# Altium project PS-010 Main.PrjPcb (part 2 of 2)

## Sheet Sheet4.SchDoc: Power Supply Board (Main)
size B; Organization: Let's Build Rockets Inc.; DocumentNumber: PS-010_Main; Revision: A.1; SheetNumber: 2
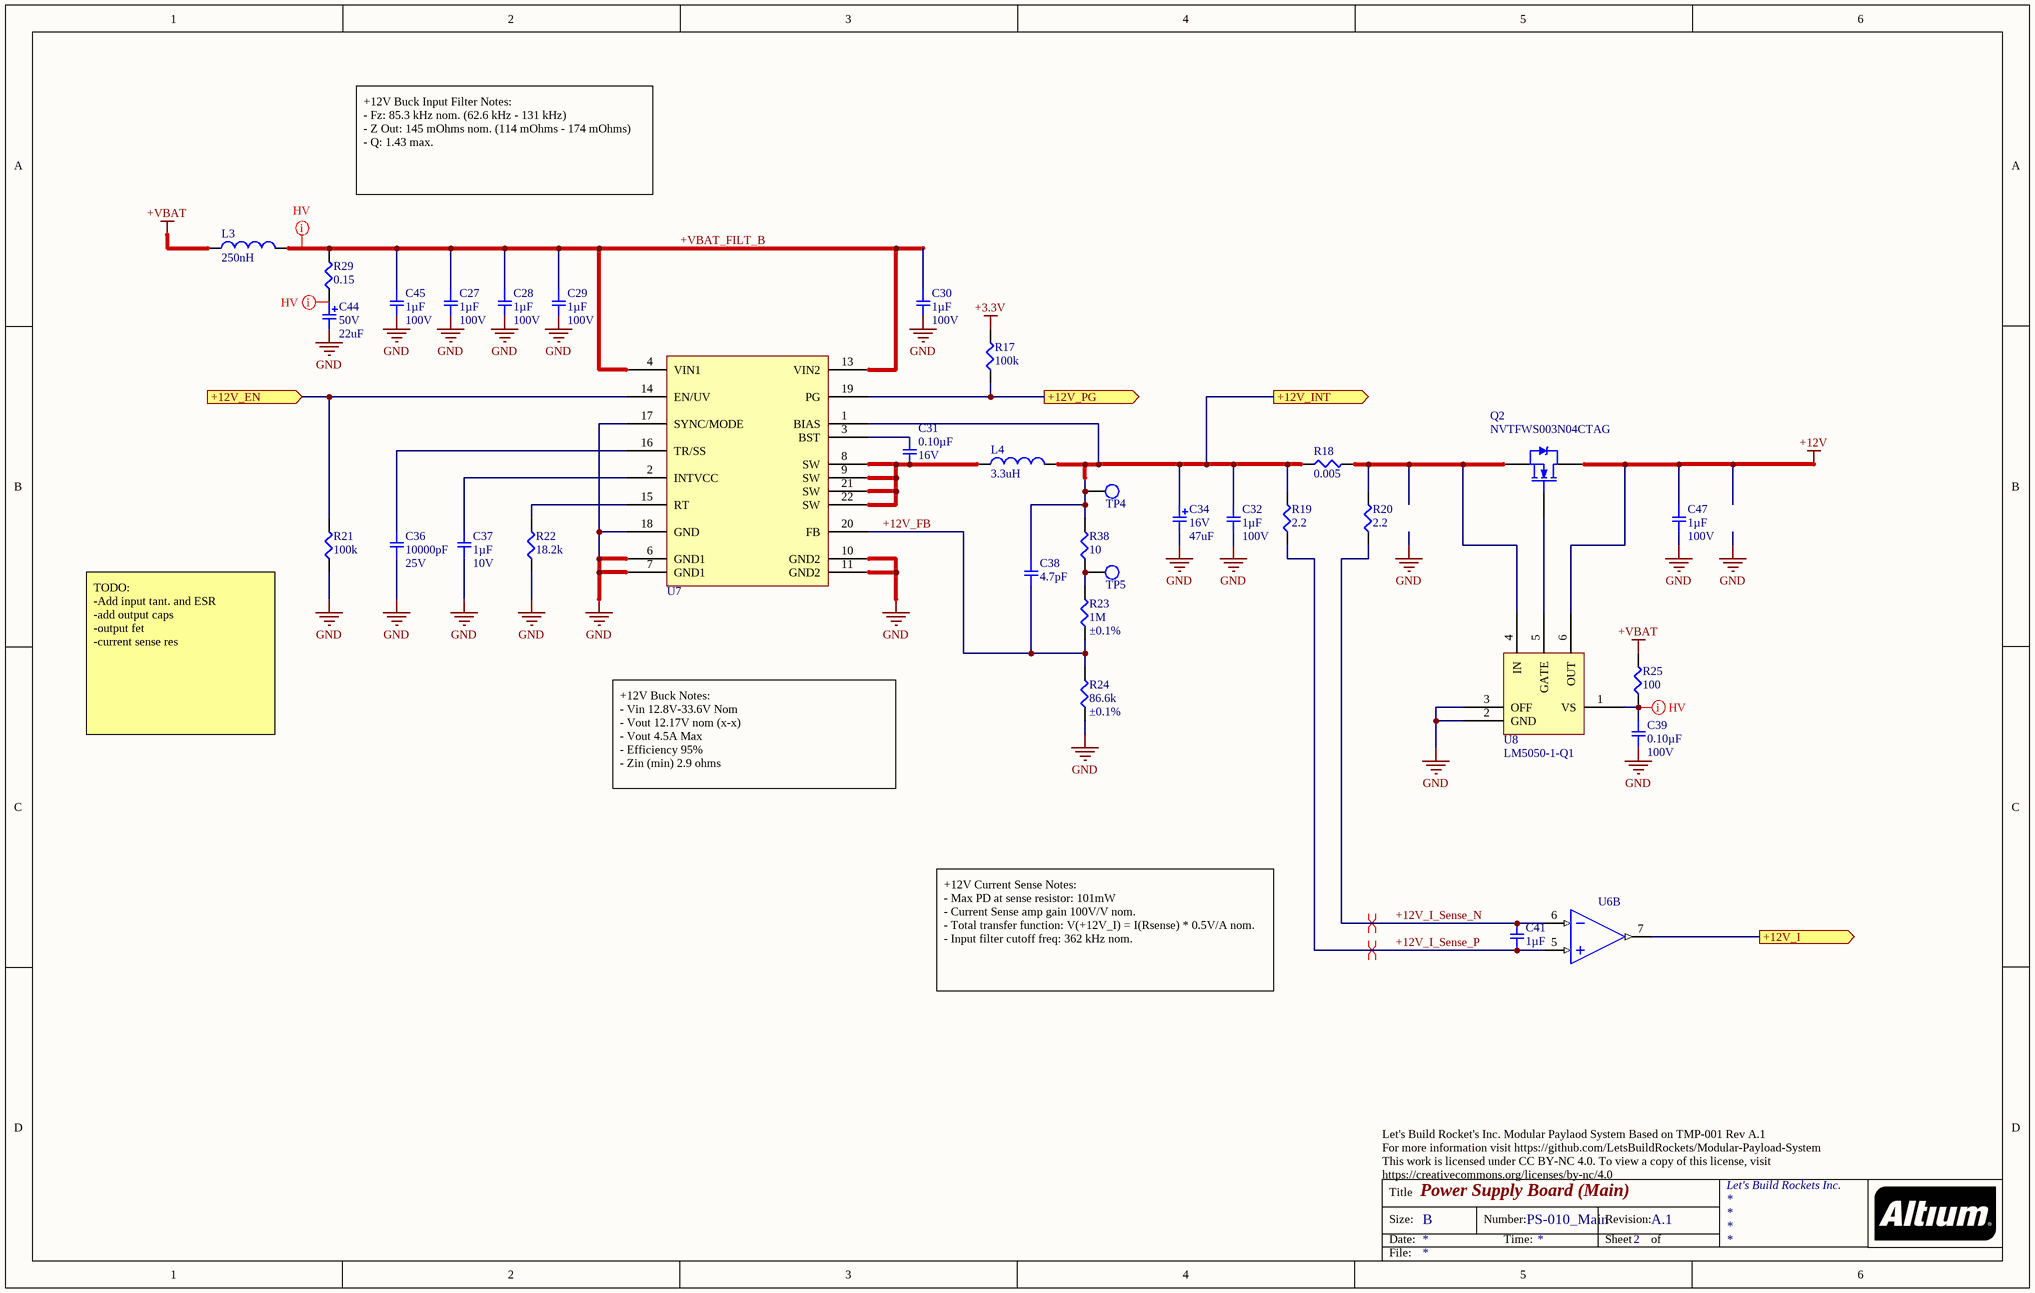
[diagram p3: Sheet4.SchDoc]

### Parts
C27  1µF  Voltage: 100V  [SMD-0805C]
C28  1µF  Voltage: 100V  [SMD-0805C]
C29  1µF  Voltage: 100V  [SMD-0805C]
C30  1µF  Voltage: 100V  [SMD-0805C]
C31  0.10µF  Voltage: 16V  [SMD-0402C]
C32  1µF  Voltage: 100V  [SMD-0805C]
C34  value 47uF  Voltage: 16V  [KEMET W - CAPMP7343X15N]  (hidden comment: T521W476M016ATE045)
C36  10000pF  Voltage: 25V  [SMD-0402C]
C37  1µF  Voltage: 10V  [SMD-0402C]
C38  4.7pF  [SMD-0402C]
C39  0.10µF  Voltage: 100V  [SMD-0603C]
C41  1µF  [SMD-0402C]
C44  value 22uF  Voltage: 50V  [KEMET D - CAPMP7343X31N]  (hidden comment: T521D226M050ATE090)
C45  1µF  Voltage: 100V  [SMD-0805C]
C47  1µF  Voltage: 100V  [SMD-0805C]
L3  value 250nH  [INDM4040X21N (XGL4020)]  (hidden comment: XGL4020-251ME)
L4  value 3.3uH  [INDM7050X50N (Wurth)]  (hidden comment: 744314330)
Q2  NVTFWS003N04CTAG  [DFN065P305X80-8N]
R17  100k  [SMD-0402-RES]
R18  0.005  [SMD-0603-RES]
R19  2.2  [SMD-0603-RES]
R20  2.2  [SMD-0603-RES]
R21  100k  [SMD-0402-RES]
R22  18.2k  [SMD-0402-RES]
R23  1M  Tolerance: ±0.1%  [SMD-0805-RES]
R24  86.6k  Tolerance: ±0.1%  [SMD-0805-RES]
R25  100  [SMD-0402-RES]
R29  0.15  [SMD-0603-RES]
R38  10  [SMD-0402-RES]
TP4  TP  [TP_SMD_40]  (value not drawn)  (no BOM)
TP5  TP  [TP_SMD_40]  (value not drawn)  (no BOM)
U6  INA2180A3IDGKT  [TSOP65P490X110-8N]  (value not drawn)  (part B of 2)
U7  LT8640  [QFN50P300X400X80_HS-21N (LT8640)]  (value not drawn)
U8  LM5050-1-Q1  [SOT95P280X110-6N]

### Ports
+12V_EN (in), +12V_I (out), +12V_INT (out), +12V_PG (out)

### Nets
+3.3V: R17.2
+12V: C47.1 Q2.D U8.6(OUT)
+VBAT: L3.1 R25.2
GND: C27.2 C28.2 C29.2 C30.2 C32.2 C34.2 C36.1 C37.1 C39.1 C44.2 C45.2 C47.2 R21.1 R22.1 R24.1 U7.6(GND1) U7.7(GND1) U7.10(GND2) U7.11(GND2) U7.17(SYNC/MODE) U7.18(GND) U8.2(GND) U8.3(OFF)
+12V_EN: R21.2 U7.14(EN/UV) ; port +12V_EN
+12V_FB: C38.2 R23.1 R24.2 U7.20(FB)
+12V_I: U6.7(OUT2) ; port +12V_I
+12V_I_Sense_N: C41.2 R20.1 U6.6(IN-2)
+12V_I_Sense_P: C41.1 R19.1 U6.5(IN+2)
+12V_INT: C32.1 C34.1 C38.1 L4.2 R18.1 R19.2 R38.2 TP4.1 U7.1(BIAS) ; port +12V_INT
+12V_PG: R17.1 U7.19(PG) ; port +12V_PG
+VBAT_FILT_B: C27.1 C28.1 C29.1 C30.1 C45.1 L3.2 R29.2 U7.4(VIN1) U7.13(VIN2)
NetC31_1: C31.1 U7.3(BST)
NetC31_2: C31.2 L4.1 U7.8(SW) U7.9(SW) U7.21(SW) U7.22(SW)
NetC36_2: C36.2 U7.16(TR/SS)
NetC37_2: C37.2 U7.2(INTVCC)
NetC39_2: C39.2 R25.1 U8.1(VS)
NetC44_1: C44.1 R29.1
NetQ2_G: Q2.G U8.5(GATE)
NetQ2_S: Q2.S R18.2 R20.2 U8.4(IN)
NetR22_2: R22.2 U7.15(RT)
NetR23_2: R23.2 R38.1 TP5.1

### Layout directives
differential pair: +12V_I_Sense_N, +12V_I_Sense_P
net class HIghVoltage: +VBAT_FILT_B, NetC39_2, NetC44_1

### Notes on the sheet
- +12V Buck Input Filter Notes:
  - Fz: 85.3 kHz nom. (62.6 kHz - 131 kHz)
  - Z Out: 145 mOhms nom. (114 mOhms - 174 mOhms)
  - Q: 1.43 max.
- TODO:
  -Add input tant. and ESR
  -add output caps
  -output fet
  -current sense res
- +12V Buck Notes:
  - Vin 12.8V-33.6V Nom
  - Vout 12.17V nom (x-x)
  - Vout 4.5A Max
  - Efficiency 95%
  - Zin (min) 2.9 ohms
- +12V Current Sense Notes:
  - Max PD at sense resistor: 101mW
  - Current Sense amp gain 100V/V nom.
  - Total transfer function: V(+12V_I) = I(Rsense) * 0.5V/A nom.
  - Input filter cutoff freq: 362 kHz nom.
- Let's Build Rocket's Inc. Modular Paylaod System Based on TMP-001 Rev A.1
  For more information visit https://github.com/LetsBuildRockets/Modular-Payload-System
  This work is licensed under CC BY-NC 4.0. To view a copy of this license, visit https://creativecommons.org/licenses/by-nc/4.0
- Title
- Size:
- Date:
- B
- Number:
- Time:
- Revision:
- Sheet
- of
- File:

### Library data of the parts
C27-C30 C32 C45 C47 = GRJ21BC72A105KE11L: CAP CER 1UF 100V X7S 0805; Manufacturer: Murata Electronics North America; Factory Stock: 0; Unit Price (USD): 0.47; Minimum Quantity: 1; Tolerance: ±10%; Datasheets: http://www.murata.com/~/media/webrenewal/support/library/catalog/products/capacitor/mlcc/c02e.pdf; Image: //media.digikey.com/Renders/Murata%20Renders/0805%20(2012%20Metric)%20.85mm.jpg; Digi-Key Part Number: 490-10918-1-ND; Part Number: GRJ21BC72A105KE11L; Quantity Available: 16015; @ qty: 0; Packaging: Cut Tape (CT); Series: GRJ; Part Status: Active; Value: 1µF; Temperature Coefficient: X7S; Operating Temperature: -55°C ~ 125°C; Features: Soft Termination; Ratings: -; Applications: Boardflex Sensitive; Mounting Type: Surface Mount, MLCC; Package / Case: 0805 (2012 Metric); Size / Dimension: 0.079" L x 0.049" W (2.00mm x 1.25mm); Height - Seated (Max): -; Thickness (Max): 0.057" (1.45mm); Lead Spacing: -; Lead Style: -
C31 = GCM155R71C104KA55D: CAP CER 0.1UF 16V X7R 0402; Manufacturer: Murata Electronics North America; Factory Stock: 0; Unit Price (USD): 0.1; Minimum Quantity: 1; Tolerance: ±10%; Datasheets: http://www.murata.com/~/media/webrenewal/support/library/catalog/products/capacitor/mlcc/c03e.ashx; Image: //media.digikey.com/Renders/Murata%20Renders/ZRB-SERIES-0402.jpg; Digi-Key Part Number: 490-4759-1-ND; Part Number: GCM155R71C104KA55D; Quantity Available: 734194; @ qty: 0; Packaging: Cut Tape (CT); Series: GCM; Part Status: Active; Value: 0.10µF; Temperature Coefficient: X7R; Operating Temperature: -55°C ~ 125°C; Features: -; Ratings: AEC-Q200; Applications: Automotive; Mounting Type: Surface Mount, MLCC; Package / Case: 0402 (1005 Metric); Size / Dimension: 0.039" L x 0.020" W (1.00mm x 0.50mm); Height - Seated (Max): -; Thickness (Max): 0.022" (0.55mm); Lead Spacing: -; Lead Style: -
C34 = T521W476M016ATE045: ESR: 45mohm
C36 = GCM155R71E103KA37D: CAP CER 10000PF 25V X7R 0402; Manufacturer: Murata Electronics North America; Factory Stock: 0; Unit Price (USD): 0.1; Minimum Quantity: 1; Tolerance: ±10%; Datasheets: http://www.murata.com/~/media/webrenewal/support/library/catalog/products/capacitor/mlcc/c03e.ashx; Image: //media.digikey.com/Renders/Murata%20Renders/ZRB-SERIES-0402.jpg; Digi-Key Part Number: 490-6043-1-ND; Part Number: GCM155R71E103KA37D; Quantity Available: 128782; @ qty: 0; Packaging: Cut Tape (CT); Series: GCM; Part Status: Active; Value: 10000pF; Temperature Coefficient: X7R; Operating Temperature: -55°C ~ 125°C; Features: -; Ratings: AEC-Q200; Applications: Automotive; Mounting Type: Surface Mount, MLCC; Package / Case: 0402 (1005 Metric); Size / Dimension: 0.039" L x 0.020" W (1.00mm x 0.50mm); Height - Seated (Max): -; Thickness (Max): 0.022" (0.55mm); Lead Spacing: -; Lead Style: -
C37 C41 = GCM155C71A105KE38D: CAP CER 1UF 10V X7S 0402; Manufacturer: Murata Electronics North America; Factory Stock: 0; Unit Price (USD): 0.12; Minimum Quantity: 1; Tolerance: ±10%; Datasheets: http://www.murata.com/~/media/webrenewal/support/library/catalog/products/capacitor/mlcc/c03e.ashx; Image: //media.digikey.com/Renders/Murata%20Renders/ZRB-SERIES-0402.jpg; Digi-Key Part Number: 490-13409-1-ND; Part Number: GCM155C71A105KE38D; Quantity Available: 7240; @ qty: 0; Packaging: Cut Tape (CT); Series: GCM; Part Status: Active; Value: 1µF; Temperature Coefficient: X7S; Operating Temperature: -55°C ~ 125°C; Features: -; Ratings: AEC-Q200; Applications: Automotive; Mounting Type: Surface Mount, MLCC; Package / Case: 0402 (1005 Metric); Size / Dimension: 0.039" L x 0.020" W (1.00mm x 0.50mm); Height - Seated (Max): -; Thickness (Max): 0.022" (0.55mm); Lead Spacing: -; Lead Style: -
  C41: Voltage: 10V
C38 = GCM1555C1H4R7CA16D: CAP CER 4.7PF 50V NP0 0402; Manufacturer: Murata Electronics North America; Factory Stock: 0; Unit Price (USD): 0.1; Minimum Quantity: 1; Tolerance: ±0.25pF; Temperature Coefficient: C0G, NP0; Datasheets: http://www.murata.com/~/media/webrenewal/support/library/catalog/products/capacitor/mlcc/c03e.ashx; Image: //media.digikey.com/Renders/Murata%20Renders/ZRB-SERIES-0402.jpg; Digi-Key Part Number: 490-12652-1-ND; Part Number: GCM1555C1H4R7CA16D; Quantity Available: 7400; @ qty: 0; Packaging: Cut Tape (CT); Series: GCM; Part Status: Active; Value: 4.7pF; Voltage: 50V; Operating Temperature: -55°C ~ 125°C; Features: -; Ratings: AEC-Q200; Applications: Automotive; Mounting Type: Surface Mount, MLCC; Package / Case: 0402 (1005 Metric); Size / Dimension: 0.039" L x 0.020" W (1.00mm x 0.50mm); Height - Seated (Max): -; Thickness (Max): 0.022" (0.55mm); Lead Spacing: -; Lead Style: -
C39 = GRM188R72A104KA35D: CAP CER 0.1UF 100V X7R 0603; Manufacturer: Murata Electronics North America; Factory Stock: 0; Unit Price (USD): 0.2; Minimum Quantity: 1; Tolerance: ±10%; Datasheets: http://www.murata.com/~/media/webrenewal/support/library/catalog/products/capacitor/mlcc/c02e.pdf; Image: //media.digikey.com/Renders/Murata%20Renders/ZRB-SERIES-0402.jpg; Digi-Key Part Number: 490-3285-1-ND; Part Number: GRM188R72A104KA35D; Quantity Available: 924944; @ qty: 0; Packaging: Cut Tape (CT); Series: GRM; Part Status: Active; Value: 0.10µF; Temperature Coefficient: X7R; Operating Temperature: -55°C ~ 125°C; Features: -; Ratings: -; Applications: General Purpose; Mounting Type: Surface Mount, MLCC; Package / Case: 0603 (1608 Metric); Size / Dimension: 0.063" L x 0.031" W (1.60mm x 0.80mm); Height - Seated (Max): -; Thickness (Max): 0.035" (0.90mm); Lead Spacing: -; Lead Style: -
C44 = T521D226M050ATE090: ESR: 90mohm
L3 = XGL4020-251ME: DCR: 3.0mohm; Isat: 16.5A; Imax: 24A; SFR: 130MHz
L4 = 744314330: DCR: 9mohm; Isat: 8A; Imax: 9A; SFR: 65MHz; Tolerance: 20%
Q2 = NVTFWS003N04CTAG: Rds: 3.5mohm; Vgs: 20V; Power Dissipation: 3.2W; Id: 22A; VDS: 40V; Qg: 23nC; Ciss: 1600pF; Operating Temperature: -55°C ~ 175°C
R17 R21 = ERJ-2GEJ104X: RES SMD 100K OHM 5% 1/10W 0402; Manufacturer: Panasonic Electronic Components; Factory Stock: 0; Unit Price (USD): 0.00350; @ qty: 1500; Minimum Quantity: 1; Power (Watts): 0.1W, 1/10W; Temperature Coefficient: ±200ppm/°C; Part Number: ERJ-2GEJ104X; Datasheets: http://industrial.panasonic.com/www-cgi/jvcr13pz.cgi?E+PZ+3+AOA0001+ERJ2GEJ104X+7+WW; Image: //media.digikey.com/Photos/Panasonic%20Photos/ERJ-PA2-Series.jpg; Digi-Key Part Number: P100KJCT-ND; Quantity Available: 2387986; Packaging: Cut Tape (CT); Series: ERJ; Part Status: Active; Value: 100k; Tolerance: ±5%; Composition: Thick Film; Features: Automotive AEC-Q200; Operating Temperature: -55°C ~ 155°C; Package / Case: 0402 (1005 Metric); Supplier Device Package: 0402; Size / Dimension: 0.039" L x 0.020" W (1.00mm x 0.50mm); Height - Seated (Max): 0.016" (0.40mm); Number of Terminations: 2; Failure Rate: -
R18 = ERJ-3LWFR005V: RES SMD 0.005 OHM 1% 1/4W 0603; Manufacturer: Panasonic Electronic Components; Factory Stock: 0; Unit Price (USD): 0.12384; @ qty: 1500; Minimum Quantity: 1; Power (Watts): 0.25W, 1/4W; Temperature Coefficient: 0/ +700ppm/°C; Part Number: ERJ-3LWFR005V; Datasheets: https://industrial.panasonic.com/cdbs/www-data/pdf/RDA0000/AOA0000C239.pdf; Image: //media.digikey.com/Photos/Panasonic%20Photos/MFG_ERJ-P6W%20Series.jpg; Digi-Key Part Number: P19182CT-ND; Quantity Available: 2588; Packaging: Cut Tape (CT); Series: ERJ; Part Status: Active; Value: 0.005; Tolerance: ±1%; Composition: Thick Film; Features: Automotive AEC-Q200, Current Sense; Operating Temperature: -55°C ~ 125°C; Package / Case: 0603 (1608 Metric); Supplier Device Package: 0603; Size / Dimension: 0.063" L x 0.031" W (1.60mm x 0.80mm); Height - Seated (Max): 0.026" (0.65mm); Number of Terminations: 2; Failure Rate: -
R19 R20 = ERJ-3RQF2R2V: RES SMD 2.2 OHM 1% 1/10W 0603; Manufacturer: Panasonic Electronic Components; Factory Stock: 0; Unit Price (USD): 0.03510; @ qty: 1500; Minimum Quantity: 1; Power (Watts): 0.1W, 1/10W; Temperature Coefficient: ±200ppm/°C; Part Number: ERJ-3RQF2R2V; Datasheets: https://industrial.panasonic.com/cdbs/www-data/pdf/RDA0000/AOA0000C239.pdf; Image: //media.digikey.com/Photos/Panasonic%20Photos/MFG_ERJ-P6W%20Series.jpg; Digi-Key Part Number: P2.2AJCT-ND; Quantity Available: 43930; Packaging: Cut Tape (CT); Series: ERJ; Part Status: Active; Value: 2.2; Tolerance: ±1%; Composition: Thick Film; Features: Automotive AEC-Q200, Current Sense; Operating Temperature: -55°C ~ 125°C; Package / Case: 0603 (1608 Metric); Supplier Device Package: 0603; Size / Dimension: 0.063" L x 0.031" W (1.60mm x 0.80mm); Height - Seated (Max): 0.022" (0.55mm); Number of Terminations: 2; Failure Rate: -
R22 = ERJ-2RKF1822X: RES SMD 18.2K OHM 1% 1/10W 0402; Manufacturer: Panasonic Electronic Components; Factory Stock: 0; Unit Price (USD): 0.00496; @ qty: 1500; Minimum Quantity: 1; Power (Watts): 0.1W, 1/10W; Temperature Coefficient: ±100ppm/°C; Part Number: ERJ-2RKF1822X; Datasheets: http://industrial.panasonic.com/www-cgi/jvcr13pz.cgi?E+PZ+3+AOA0002+ERJ2RKF1822X+7+WW; Image: //media.digikey.com/Photos/Panasonic%20Photos/ERJ-PA2-Series.jpg; Digi-Key Part Number: P18.2KLCT-ND; Quantity Available: 142975; Packaging: Cut Tape (CT); Series: ERJ; Part Status: Active; Value: 18.2k; Tolerance: ±1%; Composition: Thick Film; Features: Automotive AEC-Q200; Operating Temperature: -55°C ~ 155°C; Package / Case: 0402 (1005 Metric); Supplier Device Package: 0402; Size / Dimension: 0.039" L x 0.020" W (1.00mm x 0.50mm); Height - Seated (Max): 0.016" (0.40mm); Number of Terminations: 2; Failure Rate: -
R23 = ERJ-PB6B1004V: RES SMD 1M OHM 0.1% 1/4W 0805; Manufacturer: Panasonic Electronic Components; Factory Stock: 0; Unit Price (USD): 0.04554; @ qty: 1000; Minimum Quantity: 1; Power (Watts): 0.25W, 1/4W; Temperature Coefficient: ±50ppm/°C; Part Number: ERJ-PB6B1004V; Datasheets: https://industrial.panasonic.com/cdbs/www-data/pdf/RDA0000/AOA0000C100.pdf; Image: //media.digikey.com/Renders/Panasonic%20Renders/ERJ-0805%20Pkg.jpg; Digi-Key Part Number: P20936CT-ND; Quantity Available: 10000; Packaging: Cut Tape (CT); Series: ERJ; Part Status: Active; Value: 1M; Composition: Thick Film; Features: Automotive AEC-Q200, Pulse Withstanding; Operating Temperature: -55°C ~ 155°C; Package / Case: 0805 (2012 Metric); Supplier Device Package: 0805; Size / Dimension: 0.079" L x 0.049" W (2.00mm x 1.25mm); Height - Seated (Max): 0.028" (0.70mm); Number of Terminations: 2; Failure Rate: -
R24 = ERJ-PB6B8662V: RES SMD 86.6k OHM 0.1% 1/4W 0805; Manufacturer: Panasonic Electronic Components; Factory Stock: 0; Unit Price (USD): 0.04554; @ qty: 1000; Minimum Quantity: 1; Power (Watts): 0.25W, 1/4W; Temperature Coefficient: ±50ppm/°C; Part Number: ERJ-PB6B8662V; Datasheets: https://industrial.panasonic.com/cdbs/www-data/pdf/RDA0000/AOA0000C100.pdf; Image: //media.digikey.com/Renders/Panasonic%20Renders/ERJ-0805%20Pkg.jpg; Digi-Key Part Number: P20815CT-ND; Quantity Available: 10000; Packaging: Cut Tape (CT); Series: ERJ; Part Status: Active; Value: 86.6k; Composition: Thick Film; Features: Automotive AEC-Q200, Pulse Withstanding; Operating Temperature: -55°C ~ 155°C; Package / Case: 0805 (2012 Metric); Supplier Device Package: 0805; Size / Dimension: 0.079" L x 0.049" W (2.00mm x 1.25mm); Height - Seated (Max): 0.028" (0.70mm); Number of Terminations: 2; Failure Rate: -
R25 = ERJ-2GEJ101X: RES SMD 100 OHM 5% 1/10W 0402; Manufacturer: Panasonic Electronic Components; Factory Stock: 0; Unit Price (USD): 0.00350; @ qty: 1500; Minimum Quantity: 1; Power (Watts): 0.1W, 1/10W; Temperature Coefficient: ±200ppm/°C; Part Number: ERJ-2GEJ101X; Datasheets: http://industrial.panasonic.com/www-cgi/jvcr13pz.cgi?E+PZ+3+AOA0001+ERJ2GEJ101X+7+WW; Image: //media.digikey.com/Photos/Panasonic%20Photos/ERJ-PA2-Series.jpg; Digi-Key Part Number: P100JCT-ND; Quantity Available: 3114113; Packaging: Cut Tape (CT); Series: ERJ; Part Status: Active; Value: 100; Tolerance: ±5%; Composition: Thick Film; Features: Automotive AEC-Q200; Operating Temperature: -55°C ~ 155°C; Package / Case: 0402 (1005 Metric); Supplier Device Package: 0402; Size / Dimension: 0.039" L x 0.020" W (1.00mm x 0.50mm); Height - Seated (Max): 0.016" (0.40mm); Number of Terminations: 2; Failure Rate: -
R29 = ERJ-3BSJR15V: RES SMD 0.15 OHM 5% 1/4W 0603; Manufacturer: Panasonic Electronic Components; Factory Stock: 0; Unit Price (USD): 0.05207; @ qty: 1500; Minimum Quantity: 1; Power (Watts): 0.25W, 1/4W; Temperature Coefficient: ±300ppm/°C; Part Number: ERJ-3BSJR15V; Datasheets: https://industrial.panasonic.com/cdbs/www-data/pdf/RDA0000/AOA0000C239.pdf; Image: //media.digikey.com/Photos/Panasonic%20Photos/MFG_ERJ-P6W%20Series.jpg; Digi-Key Part Number: P17248CT-ND; Quantity Available: 4990; Packaging: Cut Tape (CT); Series: ERJ; Part Status: Active; Value: 0.15; Tolerance: ±5%; Composition: Thick Film; Features: Automotive AEC-Q200, Current Sense; Operating Temperature: -55°C ~ 125°C; Package / Case: 0603 (1608 Metric); Supplier Device Package: 0603; Size / Dimension: 0.063" L x 0.031" W (1.60mm x 0.80mm); Height - Seated (Max): 0.022" (0.55mm); Number of Terminations: 2; Failure Rate: -
R38 = ERJ-2GEJ100X: RES SMD 10 OHM 5% 1/10W 0402; Manufacturer: Panasonic Electronic Components; Factory Stock: 0; Unit Price (USD): 0.00350; @ qty: 1500; Minimum Quantity: 1; Power (Watts): 0.1W, 1/10W; Temperature Coefficient: ±200ppm/°C; Part Number: ERJ-2GEJ100X; Datasheets: http://industrial.panasonic.com/www-cgi/jvcr13pz.cgi?E+PZ+3+AOA0001+ERJ2GEJ100X+7+WW; Image: //media.digikey.com/Photos/Panasonic%20Photos/ERJ-PA2-Series.jpg; Digi-Key Part Number: P10JCT-ND; Quantity Available: 1054751; Packaging: Cut Tape (CT); Series: ERJ; Part Status: Active; Value: 10; Tolerance: ±5%; Composition: Thick Film; Features: Automotive AEC-Q200; Operating Temperature: -55°C ~ 155°C; Package / Case: 0402 (1005 Metric); Supplier Device Package: 0402; Size / Dimension: 0.039" L x 0.020" W (1.00mm x 0.50mm); Height - Seated (Max): 0.016" (0.40mm); Number of Terminations: 2; Failure Rate: -

## Sheet Sheet5.SchDoc: Power Supply Board (Main)
size B; Organization: Let's Build Rockets Inc.; DocumentNumber: PS-010_Main; Revision: A.1; SheetNumber: 2
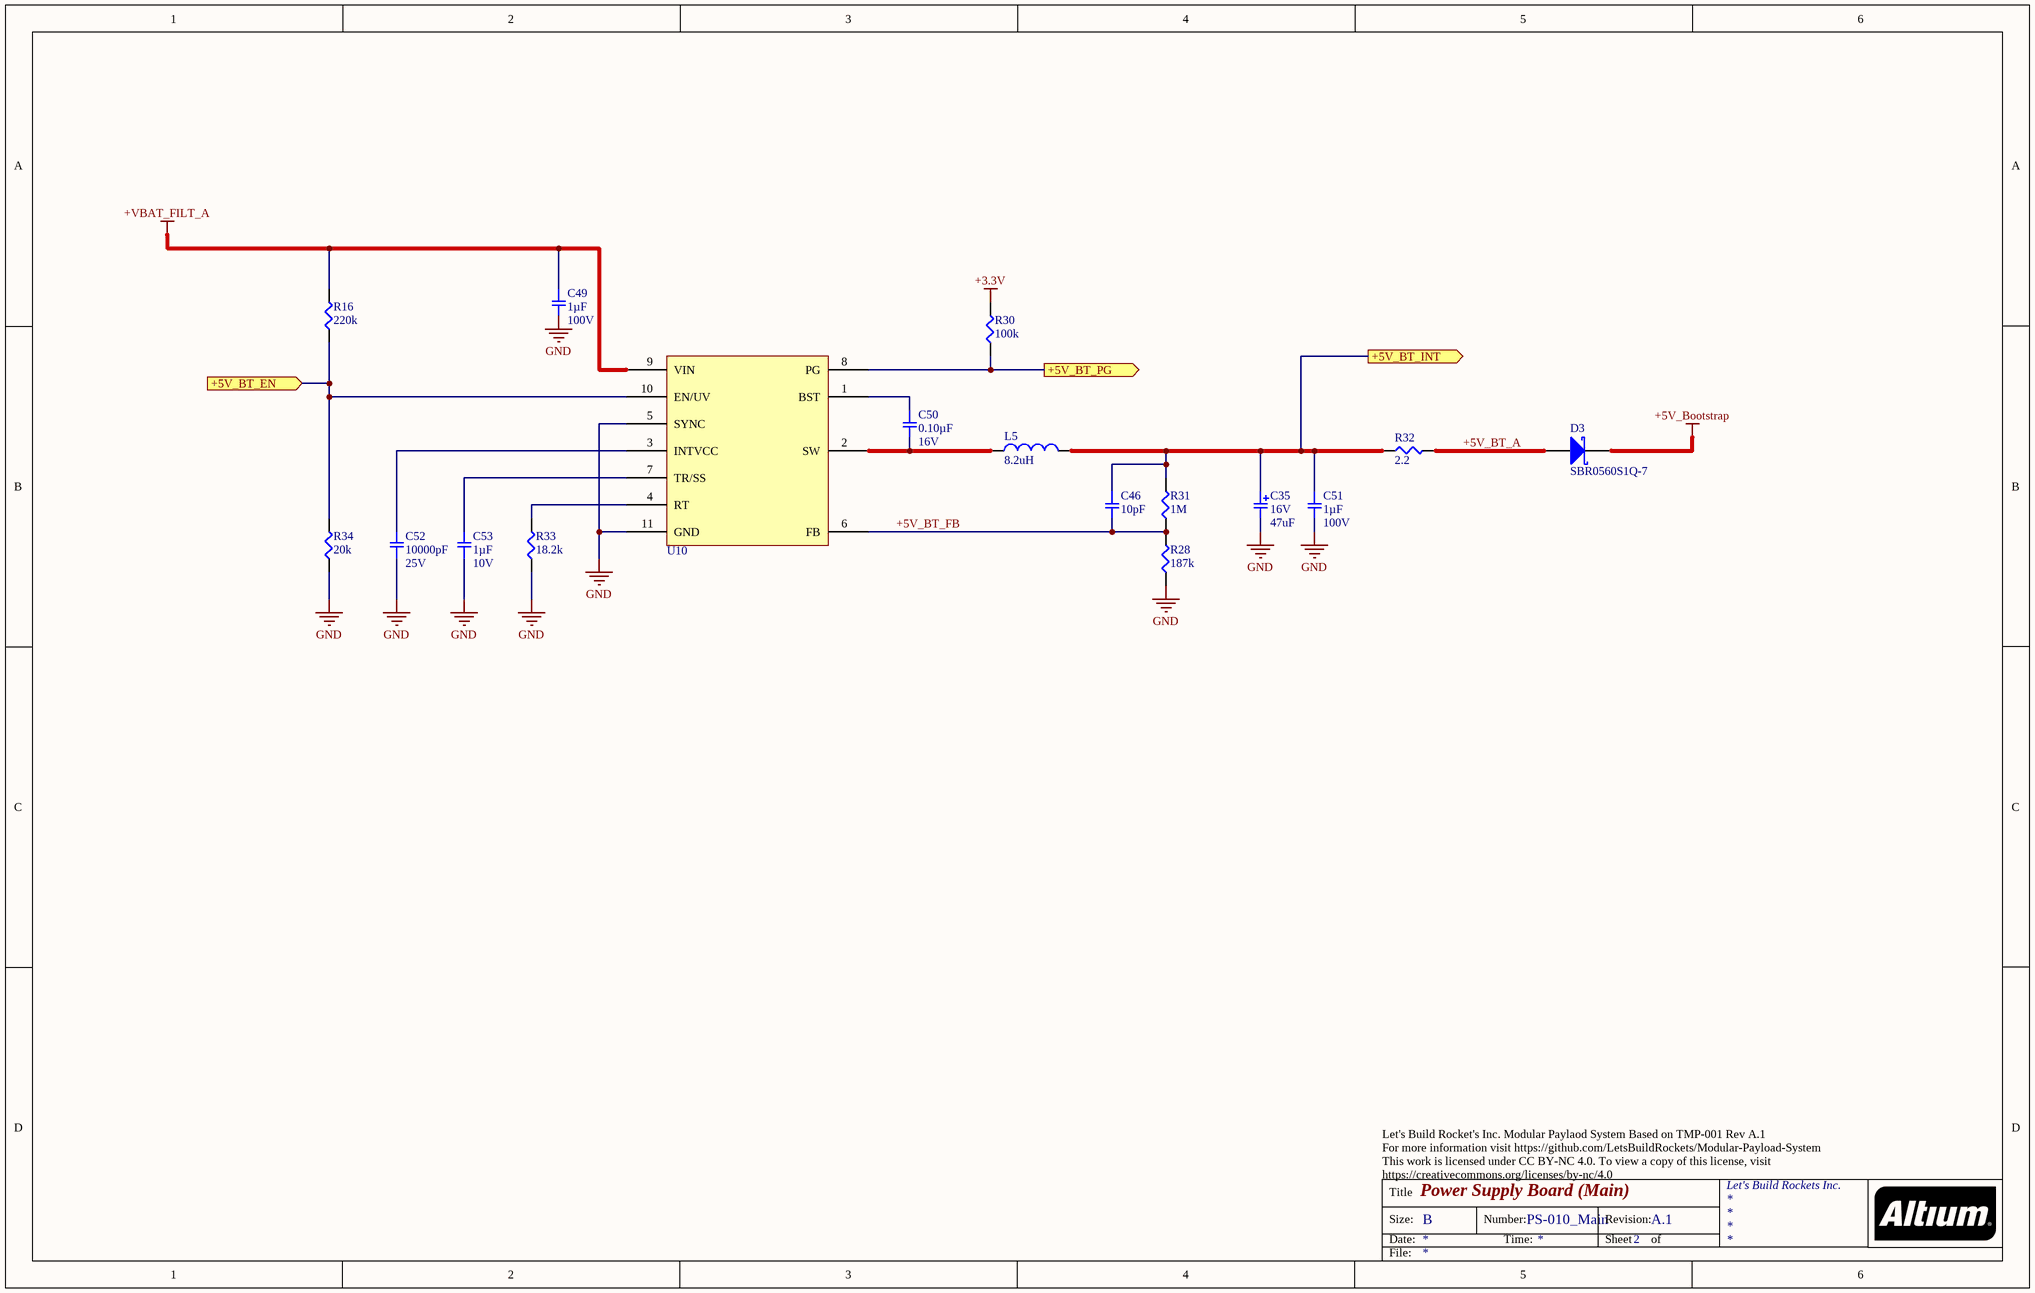
[diagram p4: Sheet5.SchDoc]

### Parts
C35  value 47uF  Voltage: 16V  [KEMET W - CAPMP7343X15N]  (hidden comment: T521W476M016ATE045)
C46  10pF  [SMD-0402C]
C49  1µF  Voltage: 100V  [SMD-0805C]
C50  0.10µF  Voltage: 16V  [SMD-0402C]
C51  1µF  Voltage: 100V  [SMD-0805C]
C52  10000pF  Voltage: 25V  [SMD-0402C]
C53  1µF  Voltage: 10V  [SMD-0402C]
D3  SBR0560S1Q-7  [SOD123]
L5  value 8.2uH  [INDM4040X21N (XGL4020)]  (hidden comment: XGL4020-882ME)
R16  220k  [SMD-0402-RES]
R28  187k  [SMD-0603-RES]
R30  100k  [SMD-0402-RES]
R31  1M  [SMD-0603-RES]
R32  2.2  [SMD-0805-RES]
R33  18.2k  [SMD-0402-RES]
R34  20k  [SMD-0402-RES]
U10  LT8606*MSE  [TSSOP50P490X110_HS-11N (LT8606MSE)]  (value not drawn)

### Ports
+5V_BT_EN (in), +5V_BT_INT (out), +5V_BT_PG (out)

### Nets
+3.3V: R30.2
+5V_Bootstrap: D3.K
+VBAT_FILT_A: C49.1 R16.2 U10.9(VIN)
GND: C35.2 C49.2 C51.2 C52.1 C53.1 R28.1 R33.1 R34.1 U10.5(SYNC) U10.11(GND)
+5V_BT_A: D3.A R32.2
+5V_BT_EN: R16.1 R34.2 U10.10(EN/UV) ; port +5V_BT_EN
+5V_BT_FB: C46.2 R28.2 R31.1 U10.6(FB)
+5V_BT_INT: C35.1 C46.1 C51.1 L5.2 R31.2 R32.1 ; port +5V_BT_INT
+5V_BT_PG: R30.1 U10.8(PG) ; port +5V_BT_PG
NetC50_1: C50.1 U10.1(BST)
NetC50_2: C50.2 L5.1 U10.2(SW)
NetC52_2: C52.2 U10.3(INTVCC)
NetC53_2: C53.2 U10.7(TR/SS)
NetR33_2: R33.2 U10.4(RT)

### Notes on the sheet
- Let's Build Rocket's Inc. Modular Paylaod System Based on TMP-001 Rev A.1
  For more information visit https://github.com/LetsBuildRockets/Modular-Payload-System
  This work is licensed under CC BY-NC 4.0. To view a copy of this license, visit https://creativecommons.org/licenses/by-nc/4.0
- Title
- Size:
- Date:
- B
- Number:
- Time:
- Revision:
- Sheet
- of
- File:

### Library data of the parts
C35 = T521W476M016ATE045: ESR: 45mohm
C46 = GCM1555C1H100JA16D: CAP CER 10PF 50V NP0 0402; Manufacturer: Murata Electronics North America; Factory Stock: 0; Unit Price (USD): 0.1; Minimum Quantity: 1; Tolerance: ±5%; Temperature Coefficient: C0G, NP0; Datasheets: http://www.murata.com/~/media/webrenewal/support/library/catalog/products/capacitor/mlcc/c03e.ashx; Image: //media.digikey.com/Renders/Murata%20Renders/ZRB-SERIES-0402.jpg; Digi-Key Part Number: 490-10668-1-ND; Part Number: GCM1555C1H100JA16D; Quantity Available: 966; @ qty: 0; Packaging: Cut Tape (CT); Series: GCM; Part Status: Active; Value: 10pF; Voltage: 50V; Operating Temperature: -55°C ~ 125°C; Features: -; Ratings: AEC-Q200; Applications: Automotive; Mounting Type: Surface Mount, MLCC; Package / Case: 0402 (1005 Metric); Size / Dimension: 0.039" L x 0.020" W (1.00mm x 0.50mm); Height - Seated (Max): -; Thickness (Max): 0.022" (0.55mm); Lead Spacing: -; Lead Style: -
C49 C51 = GRJ21BC72A105KE11L: as C27 on sheet Sheet4; Datasheets: http://www.murata.com/~/media/webrenewal/support/library/catalog/products/capacitor/mlcc/c02e.pdf; Image: //media.digikey.com/Renders/Murata%20Renders/0805%20(2012%20Metric)%20.85mm.jpg; Digi-Key Part Number: 490-10918-1-ND; Part Number: GRJ21BC72A105KE11L; Quantity Available: 16015; @ qty: 0; Packaging: Cut Tape (CT); Series: GRJ; Part Status: Active; Value: 1µF; Temperature Coefficient: X7S; Operating Temperature: -55°C ~ 125°C; Features: Soft Termination; Ratings: -; Applications: Boardflex Sensitive; Mounting Type: Surface Mount, MLCC; Package / Case: 0805 (2012 Metric); Size / Dimension: 0.079" L x 0.049" W (2.00mm x 1.25mm); Height - Seated (Max): -; Thickness (Max): 0.057" (1.45mm); Lead Spacing: -; Lead Style: -
C50 = GCM155R71C104KA55D: as C31 on sheet Sheet4; Datasheets: http://www.murata.com/~/media/webrenewal/support/library/catalog/products/capacitor/mlcc/c03e.ashx; Image: //media.digikey.com/Renders/Murata%20Renders/ZRB-SERIES-0402.jpg; Digi-Key Part Number: 490-4759-1-ND; Part Number: GCM155R71C104KA55D; Quantity Available: 734194; @ qty: 0; Packaging: Cut Tape (CT); Series: GCM; Part Status: Active; Value: 0.10µF; Temperature Coefficient: X7R; Operating Temperature: -55°C ~ 125°C; Features: -; Ratings: AEC-Q200; Applications: Automotive; Mounting Type: Surface Mount, MLCC; Package / Case: 0402 (1005 Metric); Size / Dimension: 0.039" L x 0.020" W (1.00mm x 0.50mm); Height - Seated (Max): -; Thickness (Max): 0.022" (0.55mm); Lead Spacing: -; Lead Style: -
C52 = GCM155R71E103KA37D: as C36 on sheet Sheet4; Datasheets: http://www.murata.com/~/media/webrenewal/support/library/catalog/products/capacitor/mlcc/c03e.ashx; Image: //media.digikey.com/Renders/Murata%20Renders/ZRB-SERIES-0402.jpg; Digi-Key Part Number: 490-6043-1-ND; Part Number: GCM155R71E103KA37D; Quantity Available: 128782; @ qty: 0; Packaging: Cut Tape (CT); Series: GCM; Part Status: Active; Value: 10000pF; Temperature Coefficient: X7R; Operating Temperature: -55°C ~ 125°C; Features: -; Ratings: AEC-Q200; Applications: Automotive; Mounting Type: Surface Mount, MLCC; Package / Case: 0402 (1005 Metric); Size / Dimension: 0.039" L x 0.020" W (1.00mm x 0.50mm); Height - Seated (Max): -; Thickness (Max): 0.022" (0.55mm); Lead Spacing: -; Lead Style: -
C53 = GCM155C71A105KE38D: as C37 on sheet Sheet4; Datasheets: http://www.murata.com/~/media/webrenewal/support/library/catalog/products/capacitor/mlcc/c03e.ashx; Image: //media.digikey.com/Renders/Murata%20Renders/ZRB-SERIES-0402.jpg; Digi-Key Part Number: 490-13409-1-ND; Part Number: GCM155C71A105KE38D; Quantity Available: 7240; @ qty: 0; Packaging: Cut Tape (CT); Series: GCM; Part Status: Active; Value: 1µF; Temperature Coefficient: X7S; Operating Temperature: -55°C ~ 125°C; Features: -; Ratings: AEC-Q200; Applications: Automotive; Mounting Type: Surface Mount, MLCC; Package / Case: 0402 (1005 Metric); Size / Dimension: 0.039" L x 0.020" W (1.00mm x 0.50mm); Height - Seated (Max): -; Thickness (Max): 0.022" (0.55mm); Lead Spacing: -; Lead Style: -
L5 = XGL4020-882ME: DCR: 78.1mohm; Isat: 3.2A; Imax: 4.1A; SFR: 20MHz
R16 = ERJ-2RKF2203X: RES SMD 220K OHM 1% 1/10W 0402; Manufacturer: Panasonic Electronic Components; Factory Stock: 0; Unit Price (USD): 0.00496; @ qty: 1500; Minimum Quantity: 1; Power (Watts): 0.1W, 1/10W; Temperature Coefficient: ±100ppm/°C; Part Number: ERJ-2RKF2203X; Datasheets: http://industrial.panasonic.com/www-cgi/jvcr13pz.cgi?E+PZ+3+AOA0002+ERJ2RKF2203X+7+WW; Image: //media.digikey.com/Photos/Panasonic%20Photos/ERJ-PA2-Series.jpg; Digi-Key Part Number: P220KLCT-ND; Quantity Available: 68938; Packaging: Cut Tape (CT); Series: ERJ; Part Status: Active; Value: 220k; Tolerance: ±1%; Composition: Thick Film; Features: Automotive AEC-Q200; Operating Temperature: -55°C ~ 155°C; Package / Case: 0402 (1005 Metric); Supplier Device Package: 0402; Size / Dimension: 0.039" L x 0.020" W (1.00mm x 0.50mm); Height - Seated (Max): 0.016" (0.40mm); Number of Terminations: 2; Failure Rate: -
R28 = ERJ-3EKF1873V: RES SMD 187K OHM 1% 1/10W 0603; Manufacturer: Panasonic Electronic Components; Factory Stock: 0; Unit Price (USD): 0.00379; @ qty: 1500; Minimum Quantity: 1; Power (Watts): 0.1W, 1/10W; Temperature Coefficient: ±100ppm/°C; Part Number: ERJ-3EKF1873V; Datasheets: http://industrial.panasonic.com/www-cgi/jvcr13pz.cgi?E+PZ+3+AOA0002+ERJ3EKF1873V+7+WW; Image: //media.digikey.com/Photos/Panasonic%20Photos/MFG_ERJ-P6W%20Series.jpg; Digi-Key Part Number: P187KHCT-ND; Quantity Available: 86417; Packaging: Cut Tape (CT); Series: ERJ; Part Status: Active; Value: 187k; Tolerance: ±1%; Composition: Thick Film; Features: Automotive AEC-Q200; Operating Temperature: -55°C ~ 155°C; Package / Case: 0603 (1608 Metric); Supplier Device Package: 0603; Size / Dimension: 0.063" L x 0.031" W (1.60mm x 0.80mm); Height - Seated (Max): 0.022" (0.55mm); Number of Terminations: 2; Failure Rate: -
R30 = ERJ-2GEJ104X: as R17 on sheet Sheet4; Part Number: ERJ-2GEJ104X; Datasheets: http://industrial.panasonic.com/www-cgi/jvcr13pz.cgi?E+PZ+3+AOA0001+ERJ2GEJ104X+7+WW; Image: //media.digikey.com/Photos/Panasonic%20Photos/ERJ-PA2-Series.jpg; Digi-Key Part Number: P100KJCT-ND; Quantity Available: 2387986; Packaging: Cut Tape (CT); Series: ERJ; Part Status: Active; Value: 100k; Tolerance: ±5%; Composition: Thick Film; Features: Automotive AEC-Q200; Operating Temperature: -55°C ~ 155°C; Package / Case: 0402 (1005 Metric); Supplier Device Package: 0402; Size / Dimension: 0.039" L x 0.020" W (1.00mm x 0.50mm); Height - Seated (Max): 0.016" (0.40mm); Number of Terminations: 2; Failure Rate: -
R31 = ERJ-3EKF1004V: RES SMD 1M OHM 1% 1/10W 0603; Manufacturer: Panasonic Electronic Components; Factory Stock: 0; Unit Price (USD): 0.00379; @ qty: 1500; Minimum Quantity: 1; Power (Watts): 0.1W, 1/10W; Temperature Coefficient: ±100ppm/°C; Part Number: ERJ-3EKF1004V; Datasheets: http://industrial.panasonic.com/www-cgi/jvcr13pz.cgi?E+PZ+3+AOA0002+ERJ3EKF1004V+7+WW; Image: //media.digikey.com/Photos/Panasonic%20Photos/MFG_ERJ-P6W%20Series.jpg; Digi-Key Part Number: P1.00MHCT-ND; Quantity Available: 1632074; Packaging: Cut Tape (CT); Series: ERJ; Part Status: Active; Value: 1M; Tolerance: ±1%; Composition: Thick Film; Features: Automotive AEC-Q200; Operating Temperature: -55°C ~ 155°C; Package / Case: 0603 (1608 Metric); Supplier Device Package: 0603; Size / Dimension: 0.063" L x 0.031" W (1.60mm x 0.80mm); Height - Seated (Max): 0.022" (0.55mm); Number of Terminations: 2; Failure Rate: -
R32 = ERJ-6GEYJ2R2V: RES SMD 2.2 OHM 5% 1/8W 0805; Manufacturer: Panasonic Electronic Components; Factory Stock: 0; Unit Price (USD): 0.00496; @ qty: 1500; Minimum Quantity: 1; Power (Watts): 0.125W, 1/8W; Temperature Coefficient: -100/ +600ppm/°C; Part Number: ERJ-6GEYJ2R2V; Datasheets: http://industrial.panasonic.com/www-cgi/jvcr13pz.cgi?E+PZ+3+AOA0001+ERJ6GEYJ2R2V+7+WW; Image: //media.digikey.com/Renders/Panasonic%20Renders/ERJ-0805%20Pkg.jpg; Digi-Key Part Number: P2.2ACT-ND; Quantity Available: 74294; Packaging: Cut Tape (CT); Series: ERJ; Part Status: Active; Value: 2.2; Tolerance: ±5%; Composition: Thick Film; Features: Automotive AEC-Q200; Operating Temperature: -55°C ~ 155°C; Package / Case: 0805 (2012 Metric); Supplier Device Package: 0805; Size / Dimension: 0.079" L x 0.049" W (2.00mm x 1.25mm); Height - Seated (Max): 0.028" (0.70mm); Number of Terminations: 2; Failure Rate: -
R33 = ERJ-2RKF1822X: as R22 on sheet Sheet4; Part Number: ERJ-2RKF1822X; Datasheets: http://industrial.panasonic.com/www-cgi/jvcr13pz.cgi?E+PZ+3+AOA0002+ERJ2RKF1822X+7+WW; Image: //media.digikey.com/Photos/Panasonic%20Photos/ERJ-PA2-Series.jpg; Digi-Key Part Number: P18.2KLCT-ND; Quantity Available: 142975; Packaging: Cut Tape (CT); Series: ERJ; Part Status: Active; Value: 18.2k; Tolerance: ±1%; Composition: Thick Film; Features: Automotive AEC-Q200; Operating Temperature: -55°C ~ 155°C; Package / Case: 0402 (1005 Metric); Supplier Device Package: 0402; Size / Dimension: 0.039" L x 0.020" W (1.00mm x 0.50mm); Height - Seated (Max): 0.016" (0.40mm); Number of Terminations: 2; Failure Rate: -
R34 = ERJ-2RKF2002X: RES SMD 20K OHM 1% 1/10W 0402; Manufacturer: Panasonic Electronic Components; Factory Stock: 0; Unit Price (USD): 0.00496; @ qty: 1500; Minimum Quantity: 1; Power (Watts): 0.1W, 1/10W; Temperature Coefficient: ±100ppm/°C; Part Number: ERJ-2RKF2002X; Datasheets: http://industrial.panasonic.com/www-cgi/jvcr13pz.cgi?E+PZ+3+AOA0002+ERJ2RKF2002X+7+WW; Image: //media.digikey.com/Photos/Panasonic%20Photos/ERJ-PA2-Series.jpg; Digi-Key Part Number: P20.0KLCT-ND; Quantity Available: 1690955; Packaging: Cut Tape (CT); Series: ERJ; Part Status: Active; Value: 20k; Tolerance: ±1%; Composition: Thick Film; Features: Automotive AEC-Q200; Operating Temperature: -55°C ~ 155°C; Package / Case: 0402 (1005 Metric); Supplier Device Package: 0402; Size / Dimension: 0.039" L x 0.020" W (1.00mm x 0.50mm); Height - Seated (Max): 0.016" (0.40mm); Number of Terminations: 2; Failure Rate: -

## Sheet Sheet6.SchDoc: Power Supply Board (Main)
size B; Organization: Let's Build Rockets Inc.; DocumentNumber: PS-010_Main; Revision: A.1; SheetNumber: 2
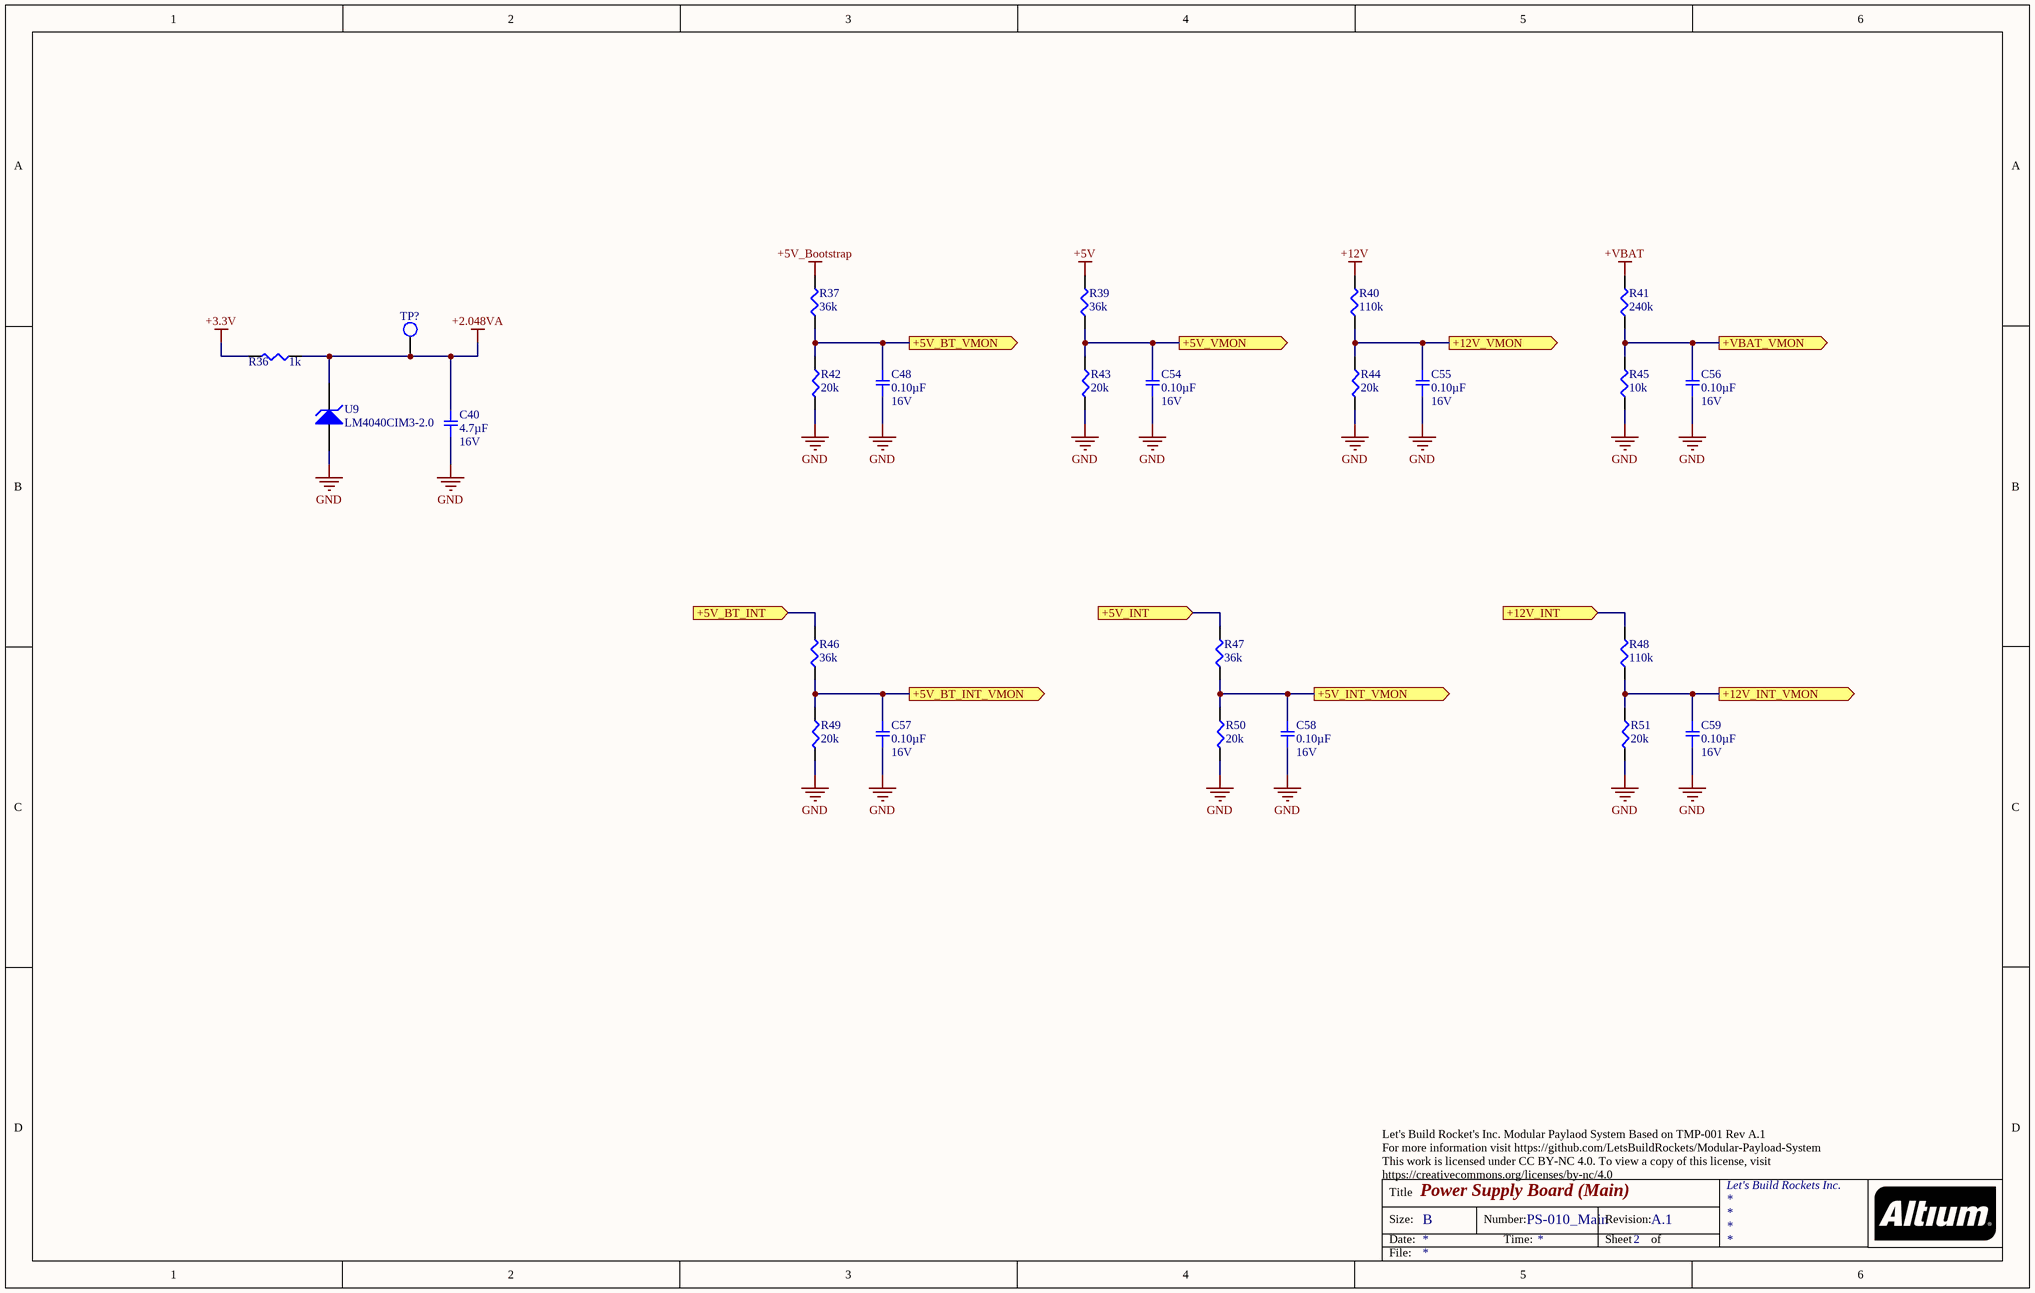
[diagram p5: Sheet6.SchDoc]

### Parts
C40  4.7µF  Voltage: 16V  [SMD-0805C]
C48  0.10µF  Voltage: 16V  [SMD-0402C]
C54  0.10µF  Voltage: 16V  [SMD-0402C]
C55  0.10µF  Voltage: 16V  [SMD-0402C]
C56  0.10µF  Voltage: 16V  [SMD-0402C]
C57  0.10µF  Voltage: 16V  [SMD-0402C]
C58  0.10µF  Voltage: 16V  [SMD-0402C]
C59  0.10µF  Voltage: 16V  [SMD-0402C]
R36  1k  [SMD-0402-RES]
R37  36k  [SMD-0805-RES]
R39  36k  [SMD-0805-RES]
R40  110k  [SMD-0805-RES]
R41  240k  [SMD-0805-RES]
R42  20k  [SMD-0805-RES]
R43  20k  [SMD-0805-RES]
R44  20k  [SMD-0805-RES]
R45  10k  [SMD-0805-RES]
R46  36k  [SMD-0805-RES]
R47  36k  [SMD-0805-RES]
R48  110k  [SMD-0805-RES]
R49  20k  [SMD-0805-RES]
R50  20k  [SMD-0805-RES]
R51  20k  [SMD-0805-RES]
TP?  TP  [TP_SMD_40]  (value not drawn)  (no BOM)
U9  LM4040CIM3-2.0  [SOT95P237X112-3N (LM4040)]

### Ports
+5V_BT_INT (in), +5V_BT_INT_VMON (out), +5V_BT_VMON (out), +5V_INT (in), +5V_INT_VMON (out), +5V_VMON (out), +12V_INT (in), +12V_INT_VMON (out), +12V_VMON (out), +VBAT_VMON (out)

### Nets
+2.048VA: C40.2 R36.1 TP?.1 U9.K
+3.3V: R36.2
+5V: R39.2
+5V_Bootstrap: R37.2
+12V: R40.2
+VBAT: R41.2
GND: C40.1 C48.1 C54.1 C55.1 C56.1 C57.1 C58.1 C59.1 R42.2 R43.2 R44.2 R45.1 R49.2 R50.2 R51.2 U9.A
+5V_BT_INT: R46.2 ; port +5V_BT_INT
+5V_BT_INT_VMON: C57.2 R46.1 R49.1 ; port +5V_BT_INT_VMON
+5V_BT_VMON: C48.2 R37.1 R42.1 ; port +5V_BT_VMON
+5V_INT: R47.2 ; port +5V_INT
+5V_INT_VMON: C58.2 R47.1 R50.1 ; port +5V_INT_VMON
+5V_VMON: C54.2 R39.1 R43.1 ; port +5V_VMON
+12V_INT: R48.2 ; port +12V_INT
+12V_INT_VMON: C59.2 R48.1 R51.1 ; port +12V_INT_VMON
+12V_VMON: C55.2 R40.1 R44.1 ; port +12V_VMON
+VBAT_VMON: C56.2 R41.1 R45.2 ; port +VBAT_VMON

### Notes on the sheet
- Let's Build Rocket's Inc. Modular Paylaod System Based on TMP-001 Rev A.1
  For more information visit https://github.com/LetsBuildRockets/Modular-Payload-System
  This work is licensed under CC BY-NC 4.0. To view a copy of this license, visit https://creativecommons.org/licenses/by-nc/4.0
- Title
- Size:
- Date:
- B
- Number:
- Time:
- Revision:
- Sheet
- of
- File:

### Library data of the parts
C40 = GCJ21BR71C475KA01L: CAP CER 4.7UF 16V X7R 0805; Manufacturer: Murata Electronics North America; Factory Stock: 0; Unit Price (USD): 0.44; Minimum Quantity: 1; Tolerance: ±10%; Datasheets: http://www.murata.com/~/media/webrenewal/support/library/catalog/products/capacitor/mlcc/c03e.ashx; Image: //media.digikey.com/Renders/Murata%20Renders/0805%20(2012%20Metric)%20.85mm.jpg; Digi-Key Part Number: 490-10557-1-ND; Part Number: GCJ21BR71C475KA01L; Quantity Available: 53217; @ qty: 0; Packaging: Cut Tape (CT); Series: GCJ; Part Status: Active; Value: 4.7µF; Temperature Coefficient: X7R; Operating Temperature: -55°C ~ 125°C; Features: Soft Termination; Ratings: AEC-Q200; Applications: Automotive, Boardflex Sensitive; Mounting Type: Surface Mount, MLCC; Package / Case: 0805 (2012 Metric); Size / Dimension: 0.079" L x 0.049" W (2.00mm x 1.25mm); Height - Seated (Max): -; Thickness (Max): 0.057" (1.45mm); Lead Spacing: -; Lead Style: -
C48 C54-C59 = GCM155R71C104KA55D: as C31 on sheet Sheet4; Datasheets: http://www.murata.com/~/media/webrenewal/support/library/catalog/products/capacitor/mlcc/c03e.ashx; Image: //media.digikey.com/Renders/Murata%20Renders/ZRB-SERIES-0402.jpg; Digi-Key Part Number: 490-4759-1-ND; Part Number: GCM155R71C104KA55D; Quantity Available: 734194; @ qty: 0; Packaging: Cut Tape (CT); Series: GCM; Part Status: Active; Value: 0.10µF; Temperature Coefficient: X7R; Operating Temperature: -55°C ~ 125°C; Features: -; Ratings: AEC-Q200; Applications: Automotive; Mounting Type: Surface Mount, MLCC; Package / Case: 0402 (1005 Metric); Size / Dimension: 0.039" L x 0.020" W (1.00mm x 0.50mm); Height - Seated (Max): -; Thickness (Max): 0.022" (0.55mm); Lead Spacing: -; Lead Style: -
R36 = ERJ-2GEJ102X: RES SMD 1K OHM 5% 1/10W 0402; Manufacturer: Panasonic Electronic Components; Factory Stock: 0; Unit Price (USD): 0.00350; @ qty: 1500; Minimum Quantity: 1; Power (Watts): 0.1W, 1/10W; Temperature Coefficient: ±200ppm/°C; Part Number: ERJ-2GEJ102X; Datasheets: http://industrial.panasonic.com/www-cgi/jvcr13pz.cgi?E+PZ+3+AOA0001+ERJ2GEJ102X+7+WW; Image: //media.digikey.com/Photos/Panasonic%20Photos/ERJ-PA2-Series.jpg; Digi-Key Part Number: P1.0KJCT-ND; Quantity Available: 1939857; Packaging: Cut Tape (CT); Series: ERJ; Part Status: Active; Value: 1k; Tolerance: ±5%; Composition: Thick Film; Features: Automotive AEC-Q200; Operating Temperature: -55°C ~ 155°C; Package / Case: 0402 (1005 Metric); Supplier Device Package: 0402; Size / Dimension: 0.039" L x 0.020" W (1.00mm x 0.50mm); Height - Seated (Max): 0.016" (0.40mm); Number of Terminations: 2; Failure Rate: -
R37 R39 R46 R47 = ERJ-PB6B3602V: RES SMD 36K OHM 0.1% 1/4W 0805; Manufacturer: Panasonic Electronic Components; Factory Stock: 0; Unit Price (USD): 0.04554; @ qty: 1000; Minimum Quantity: 1; Power (Watts): 0.25W, 1/4W; Temperature Coefficient: ±50ppm/°C; Part Number: ERJ-PB6B3602V; Datasheets: https://industrial.panasonic.com/cdbs/www-data/pdf/RDA0000/AOA0000C100.pdf; Image: //media.digikey.com/Renders/Panasonic%20Renders/ERJ-0805%20Pkg.jpg; Digi-Key Part Number: P20770CT-ND; Quantity Available: 10000; Packaging: Cut Tape (CT); Series: ERJ; Part Status: Active; Value: 36k; Tolerance: ±0.1%; Composition: Thick Film; Features: Automotive AEC-Q200, Pulse Withstanding; Operating Temperature: -55°C ~ 155°C; Package / Case: 0805 (2012 Metric); Supplier Device Package: 0805; Size / Dimension: 0.079" L x 0.049" W (2.00mm x 1.25mm); Height - Seated (Max): 0.028" (0.70mm); Number of Terminations: 2; Failure Rate: -
R40 R48 = ERJ-PB6B1103V: RES SMD 110K OHM 0.1% 1/4W 0805; Manufacturer: Panasonic Electronic Components; Factory Stock: 0; Unit Price (USD): 0.04554; @ qty: 1000; Minimum Quantity: 1; Power (Watts): 0.25W, 1/4W; Temperature Coefficient: ±50ppm/°C; Part Number: ERJ-PB6B1103V; Datasheets: https://industrial.panasonic.com/cdbs/www-data/pdf/RDA0000/AOA0000C100.pdf; Image: //media.digikey.com/Renders/Panasonic%20Renders/ERJ-0805%20Pkg.jpg; Digi-Key Part Number: P20826CT-ND; Quantity Available: 10000; Packaging: Cut Tape (CT); Series: ERJ; Part Status: Active; Value: 110k; Tolerance: ±0.1%; Composition: Thick Film; Features: Automotive AEC-Q200, Pulse Withstanding; Operating Temperature: -55°C ~ 155°C; Package / Case: 0805 (2012 Metric); Supplier Device Package: 0805; Size / Dimension: 0.079" L x 0.049" W (2.00mm x 1.25mm); Height - Seated (Max): 0.028" (0.70mm); Number of Terminations: 2; Failure Rate: -
R41 = ERJ-PB6B2403V: RES SMD 240K OHM 0.1% 1/4W 0805; Manufacturer: Panasonic Electronic Components; Factory Stock: 0; Unit Price (USD): 0.04554; @ qty: 1000; Minimum Quantity: 1; Power (Watts): 0.25W, 1/4W; Temperature Coefficient: ±50ppm/°C; Part Number: ERJ-PB6B2403V; Datasheets: https://industrial.panasonic.com/cdbs/www-data/pdf/RDA0000/AOA0000C100.pdf; Image: //media.digikey.com/Renders/Panasonic%20Renders/ERJ-0805%20Pkg.jpg; Digi-Key Part Number: P20863CT-ND; Quantity Available: 10000; Packaging: Cut Tape (CT); Series: ERJ; Part Status: Active; Value: 240k; Tolerance: ±0.1%; Composition: Thick Film; Features: Automotive AEC-Q200, Pulse Withstanding; Operating Temperature: -55°C ~ 155°C; Package / Case: 0805 (2012 Metric); Supplier Device Package: 0805; Size / Dimension: 0.079" L x 0.049" W (2.00mm x 1.25mm); Height - Seated (Max): 0.028" (0.70mm); Number of Terminations: 2; Failure Rate: -
R42-R44 R49-R51 = ERJ-PB6B2002V: RES SMD 20K OHM 0.1% 1/4W 0805; Manufacturer: Panasonic Electronic Components; Factory Stock: 0; Unit Price (USD): 0.04554; @ qty: 1000; Minimum Quantity: 1; Power (Watts): 0.25W, 1/4W; Temperature Coefficient: ±50ppm/°C; Part Number: ERJ-PB6B2002V; Datasheets: https://industrial.panasonic.com/cdbs/www-data/pdf/RDA0000/AOA0000C100.pdf; Image: //media.digikey.com/Renders/Panasonic%20Renders/ERJ-0805%20Pkg.jpg; Digi-Key Part Number: P20740CT-ND; Quantity Available: 10000; Packaging: Cut Tape (CT); Series: ERJ; Part Status: Active; Value: 20k; Tolerance: ±0.1%; Composition: Thick Film; Features: Automotive AEC-Q200, Pulse Withstanding; Operating Temperature: -55°C ~ 155°C; Package / Case: 0805 (2012 Metric); Supplier Device Package: 0805; Size / Dimension: 0.079" L x 0.049" W (2.00mm x 1.25mm); Height - Seated (Max): 0.028" (0.70mm); Number of Terminations: 2; Failure Rate: -
R45 = ERJ-PB6B1002V: RES SMD 10K OHM 0.1% 1/4W 0805; Manufacturer: Panasonic Electronic Components; Factory Stock: 0; Unit Price (USD): 0.04554; @ qty: 1000; Minimum Quantity: 1; Power (Watts): 0.25W, 1/4W; Temperature Coefficient: ±50ppm/°C; Part Number: ERJ-PB6B1002V; Datasheets: https://industrial.panasonic.com/cdbs/www-data/pdf/RDA0000/AOA0000C100.pdf; Image: //media.digikey.com/Renders/Panasonic%20Renders/ERJ-0805%20Pkg.jpg; Digi-Key Part Number: P20708CT-ND; Quantity Available: 10000; Packaging: Cut Tape (CT); Series: ERJ; Part Status: Active; Value: 10k; Tolerance: ±0.1%; Composition: Thick Film; Features: Automotive AEC-Q200, Pulse Withstanding; Operating Temperature: -55°C ~ 155°C; Package / Case: 0805 (2012 Metric); Supplier Device Package: 0805; Size / Dimension: 0.079" L x 0.049" W (2.00mm x 1.25mm); Height - Seated (Max): 0.028" (0.70mm); Number of Terminations: 2; Failure Rate: -

## Nets that join several sheets
+2.048VA: Sheet2 (C60.2 U1.4), Sheet6 (C40.2 R36.1 TP?.1 U9.K)
+3.3V: Sheet1 (7 pins), Sheet2 (14 pins), Sheet3 (R7.2), Sheet4 (R17.2), Sheet5 (R30.2), Sheet6 (R36.2)
+4.5V_INT: Sheet1 (5 pins), Sheet3 (C25.1 U6.8)
+5V: Sheet1 (19 pins), Sheet3 (C19.2 C20.1 Q1.D U5.6), Sheet6 (R39.2)
+5V_Bootstrap: Sheet1 (D2.A J1.44 P1.44), Sheet5 (D3.K), Sheet6 (R37.2)
+12V: Sheet1 (20 pins), Sheet4 (C47.1 Q2.D U8.6), Sheet6 (R40.2)
+VBAT: Sheet1 (38 pins), Sheet3 (L1.1 R15.2), Sheet4 (L3.1 R25.2), Sheet6 (R41.2)
+VBAT_FILT_A: Sheet3 (7 pins), Sheet5 (C49.1 R16.2 U10.9)
GND: Sheet1 (91 pins), Sheet2 (14 pins), Sheet3 (25 pins), Sheet4 (23 pins), Sheet5 (10 pins), Sheet6 (16 pins)
+5V_BT_INT: Sheet5 (6 pins), Sheet6 (R46.2)
+5V_BT_INT_VMON: Sheet2 (U1.12), Sheet6 (C57.2 R46.1 R49.1)
+5V_BT_PG: Sheet2 (U1.27), Sheet5 (R30.1 U10.8)
+5V_BT_VMON: Sheet2 (U1.10), Sheet6 (C48.2 R37.1 R42.1)
+5V_INT: Sheet3 (9 pins), Sheet6 (R47.2)
+5V_INT_VMON: Sheet2 (U1.13), Sheet6 (C58.2 R47.1 R50.1)
+5V_PG: Sheet2 (U1.28), Sheet3 (R7.1 U4.19)
+5V_VMON: Sheet2 (U1.11), Sheet6 (C54.2 R39.1 R43.1)
+12V_INT: Sheet4 (9 pins), Sheet6 (R48.2)
+12V_INT_VMON: Sheet2 (U1.9), Sheet6 (C59.2 R48.1 R51.1)
+12V_PG: Sheet2 (U1.29), Sheet4 (R17.1 U7.19)
+12V_VMON: Sheet2 (U1.14), Sheet6 (C55.2 R40.1 R44.1)
+VBAT_VMON: Sheet2 (U1.3), Sheet6 (C56.2 R41.1 R45.2)
CAN0_RX: Sheet1 (U3.4), Sheet2 (U1.38)
CAN0_STBY: Sheet1 (U3.8), Sheet2 (U1.41)
CAN0_TX: Sheet1 (U3.1), Sheet2 (U1.37)
CTRL_SYNC: Sheet1 (J1.26 P1.26), Sheet2 (U1.1)
DEBUG_RX: Sheet1 (P4.4), Sheet2 (U1.26)
DEBUG_TX: Sheet1 (P4.3), Sheet2 (U1.25)
DETECT_A: Sheet1 (J1.32), Sheet2 (U1.21)
DETECT_B: Sheet1 (P1.32), Sheet2 (U1.22)
RESET: Sheet1 (P3.10), Sheet2 (R5.1 U1.40)
SWCLK: Sheet1 (P3.4), Sheet2 (R2.1 U1.45)
SWDIO: Sheet1 (P3.2), Sheet2 (U1.46)